# Altium schematic sheet Analog Inputs.SchDoc: Title
size A4; Project: Q24 VCU; ENG_APP_DATE: --/--/--; DSN_APP_DATE: --/--/--; CHK_APP_DATE: --/--/--; Date: *******; ApprovedBy: *******; CheckedBy: None; Author: *******; CompanyName: *******; DrawnBy: Jacob Chisholm; Engineer: *******; Organization: *******; Address1: *******; Address2: *******; Address3: *******; Address4: *******; DocumentNumber: 14; Revision: *******; SheetNumber: 14; SheetTotal: 14; Address_Website: https://jchisholm204.github.io; E-Mail: JacobChisholm1010@gmail.com; CurrentTime: *******; CurrentDate: *******; Time: *******; DocumentFullPathAndName: *******; DocumentName: *******; ModifiedDate: *******; ImagePath: *******; ProjectName: *******; Application_BuildNumber: *******
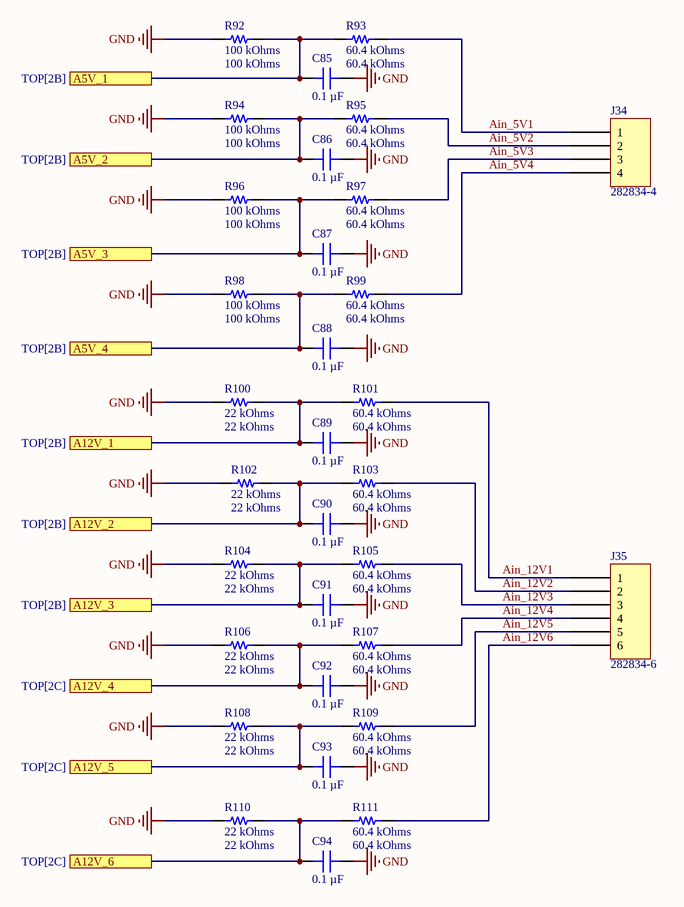
[diagram p0: Analog Inputs.SchDoc]

## Parts
C85  0.1 µF  [CAP 0603_1608]
C86  0.1 µF  [CAP 0603_1608]
C87  0.1 µF  [CAP 0603_1608]
C88  0.1 µF  [CAP 0603_1608]
C89  0.1 µF  [CAP 0603_1608]
C90  0.1 µF  [CAP 0603_1608]
C91  0.1 µF  [CAP 0603_1608]
C92  0.1 µF  [CAP 0603_1608]
C93  0.1 µF  [CAP 0603_1608]
C94  0.1 µF  [CAP 0603_1608]
J34  282834-4  [TE 282834-4]
J35  282834-6  [TE 282834-6]
R92  100 kOhms  [RES 0603_1608]
R93  60.4 kOhms  [RES 0603_1608]
R94  100 kOhms  [RES 0603_1608]
R95  60.4 kOhms  [RES 0603_1608]
R96  100 kOhms  [RES 0603_1608]
R97  60.4 kOhms  [RES 0603_1608]
R98  100 kOhms  [RES 0603_1608]
R99  60.4 kOhms  [RES 0603_1608]
R100  22 kOhms  [RES 0603_1608]
R101  60.4 kOhms  [RES 0603_1608]
R102  22 kOhms  [RES 0603_1608]
R103  60.4 kOhms  [RES 0603_1608]
R104  22 kOhms  [RES 0603_1608]
R105  60.4 kOhms  [RES 0603_1608]
R106  22 kOhms  [RES 0603_1608]
R107  60.4 kOhms  [RES 0603_1608]
R108  22 kOhms  [RES 0603_1608]
R109  60.4 kOhms  [RES 0603_1608]
R110  22 kOhms  [RES 0603_1608]
R111  60.4 kOhms  [RES 0603_1608]

## Ports
A5V_1 (see TOP[2B]), A5V_2 (see TOP[2B]), A5V_3 (see TOP[2B]), A5V_4 (see TOP[2B]), A12V_1 (see TOP[2B]), A12V_2 (see TOP[2B]), A12V_3 (see TOP[2B]), A12V_4 (see TOP[2C]), A12V_5 (see TOP[2C]), A12V_6 (see TOP[2C])

## Nets
GND: C85.2 C86.2 C87.2 C88.2 C89.2 C90.2 C91.2 C92.2 C93.2 C94.2 R92.1 R94.1 R96.1 R98.1 R100.2 R102.2 R104.2 R106.2 R108.2 R110.2
A5V_1: C85.1 R92.2 R93.1 ; port A5V_1
A5V_2: C86.1 R94.2 R95.1 ; port A5V_2
A5V_3: C87.1 R96.2 R97.1 ; port A5V_3
A5V_4: C88.1 R98.2 R99.1 ; port A5V_4
A12V_1: C89.1 R100.1 R101.2 ; port A12V_1
A12V_2: C90.1 R102.1 R103.2 ; port A12V_2
A12V_3: C91.1 R104.1 R105.2 ; port A12V_3
A12V_4: C92.1 R106.1 R107.2 ; port A12V_4
A12V_5: C93.1 R108.1 R109.2 ; port A12V_5
A12V_6: C94.1 R110.1 R111.2 ; port A12V_6
Ain_5V1: J34.1 R93.2
Ain_5V2: J34.2 R95.2
Ain_5V3: J34.3 R97.2
Ain_5V4: J34.4 R99.2
Ain_12V1: J35.1 R101.1
Ain_12V2: J35.2 R103.1
Ain_12V3: J35.3 R105.1
Ain_12V4: J35.4 R107.1
Ain_12V5: J35.5 R109.1
Ain_12V6: J35.6 R111.1

## Notes on the sheet
- Title:
- Drawn By:
- Page Contents:
- Checked By:
- Size:
- Date:
- File:
- License:
- Email:
- A4
- Number:
- Time:
- Revision:
- Sheet
- Website:
- of

## Library data of the parts
C85-C94 = 6R3X14W104MV4T: CAP CER 0.1UF 6.3V X7R 0603; manufacturer: Johanson Dielectrics Inc.; Tolerance: ±20%; Part Number: 6R3X14W104MV4T; Value: 0.1 µF; Applications: Bypass, Decoupling; Capacitance: 0.1 µF; componentlink1description: Datasheet; componentlink1url: https://www.johansondielectrics.com/downloads/x2y-filter-and-decoupling-capacitors.pdf; componentlink2description: DigiKey Link; componentlink2url: https://www.digikey.com/en/products/detail/johanson-dielectrics-inc/6R3X14W104MV4T/1556331; Device Package: 0603 (1608 Metric); Features: Low ESL (X2Y); lastupdated: 1/24/2024 8:09:44 PM; Lifecycle Status: Active; Minimum Order: 1; Mounting Type: Surface Mount, MLCC; Operating Temperature: -55°C ~ 125°C; Package / Case: 0603 (1608 Metric); packaging: TapeAndReel; partid: 2650; Part Status: Active; price: 0.08; series: X2Y®; Size / Dimension: 0.064" L x 0.035" W (1.63mm x 0.89mm); Supplier 1: DigiKey; Supplier Part Number 1: 709-1009-1-ND; Temperature Coefficient: X7R; Thickness (Max): 0.026" (0.66mm); Voltage - Rated: 6.3V
J34 = 282834-4: TERM BLK 4P SIDE ENT 2.54MM PCB; Manufacturer: TE Connectivity AMP Connectors; Current: 10A; Mating Orientation: Horizontal with Board; Number of Levels: 1; Pitch: 0.100" (2.54mm); Positions Per Level: 4; Voltage: 150V; Wire Gauge: 16-30 AWG; Wire Termination: Screw - Rising Cage Clamp; Part Number: 282834-4; Color: Green; ComponentLink1Description: Datasheet; ComponentLink1URL: https://www.te.com/commerce/DocumentDelivery/DDEController?Action=srchrtrv&DocNm=282834&DocType=Customer+Drawing&DocLang=English; ComponentLink2Description: DigiKey Link; ComponentLink2URL: http://digikey.com/product-detail/en/te-connectivity-amp-connectors/282834-4/A98335-ND/1153265; LastUpdated: 1/15/2020 4:16:05 AM; Lifecycle Status: Active; Minimum Order: 1; Mounting Type: Through Hole; Packaging: Bulk; Part Status: Active; Price: 2.68; Series: Buchanan; Supplier 1: DigiKey; Supplier Part Number 1: A98335-ND
J35 = 282834-6: TERM BLK 6P SIDE ENT 2.54MM PCB; Manufacturer: TE Connectivity AMP Connectors; Current: 10A; Mating Orientation: Horizontal with Board; Number of Levels: 1; Pitch: 0.100" (2.54mm); Positions Per Level: 6; Voltage: 150V; Wire Gauge: 16-30 AWG; Wire Termination: Screw - Rising Cage Clamp; Part Number: 282834-6; Color: Green; ComponentLink1Description: Datasheet; ComponentLink1URL: https://www.te.com/commerce/DocumentDelivery/DDEController?Action=srchrtrv&DocNm=282834&DocType=Customer+Drawing&DocLang=English; ComponentLink2Description: DigiKey Link; ComponentLink2URL: http://digikey.com/product-detail/en/te-connectivity-amp-connectors/282834-6/A98337-ND/1153267; LastUpdated: 1/15/2020 4:16:31 AM; Lifecycle Status: Active; Minimum Order: 1; Mounting Type: Through Hole; Packaging: Bulk; Part Status: Active; Price: 4.72; Series: Buchanan; Supplier 1: DigiKey; Supplier Part Number 1: A98337-ND
R92 R94 R96 R98 = AA0603FR-07100KL: RES SMD 100K OHM 1% 1/10W 0603; Part Number: AA0603FR-07100KL; Value: 100 kOhms
R93 R95 R97 R99 R101 R103 R105 R107 R109 R111 = AC0603FR-0760K4L: RES SMD 60.4K OHM 1% 1/10W 0603; Part Number: AC0603FR-0760K4L; Value: 60.4 kOhms
R100 R102 R104 R106 R108 R110 = AC0603FR-7W22KL: RES 22K OHM 1% 1/5W 0603; Part Number: AC0603FR-7W22KL; Value: 22 kOhms